# EAGLE design RamyunActionBoard (EAGLE 8.0.0)
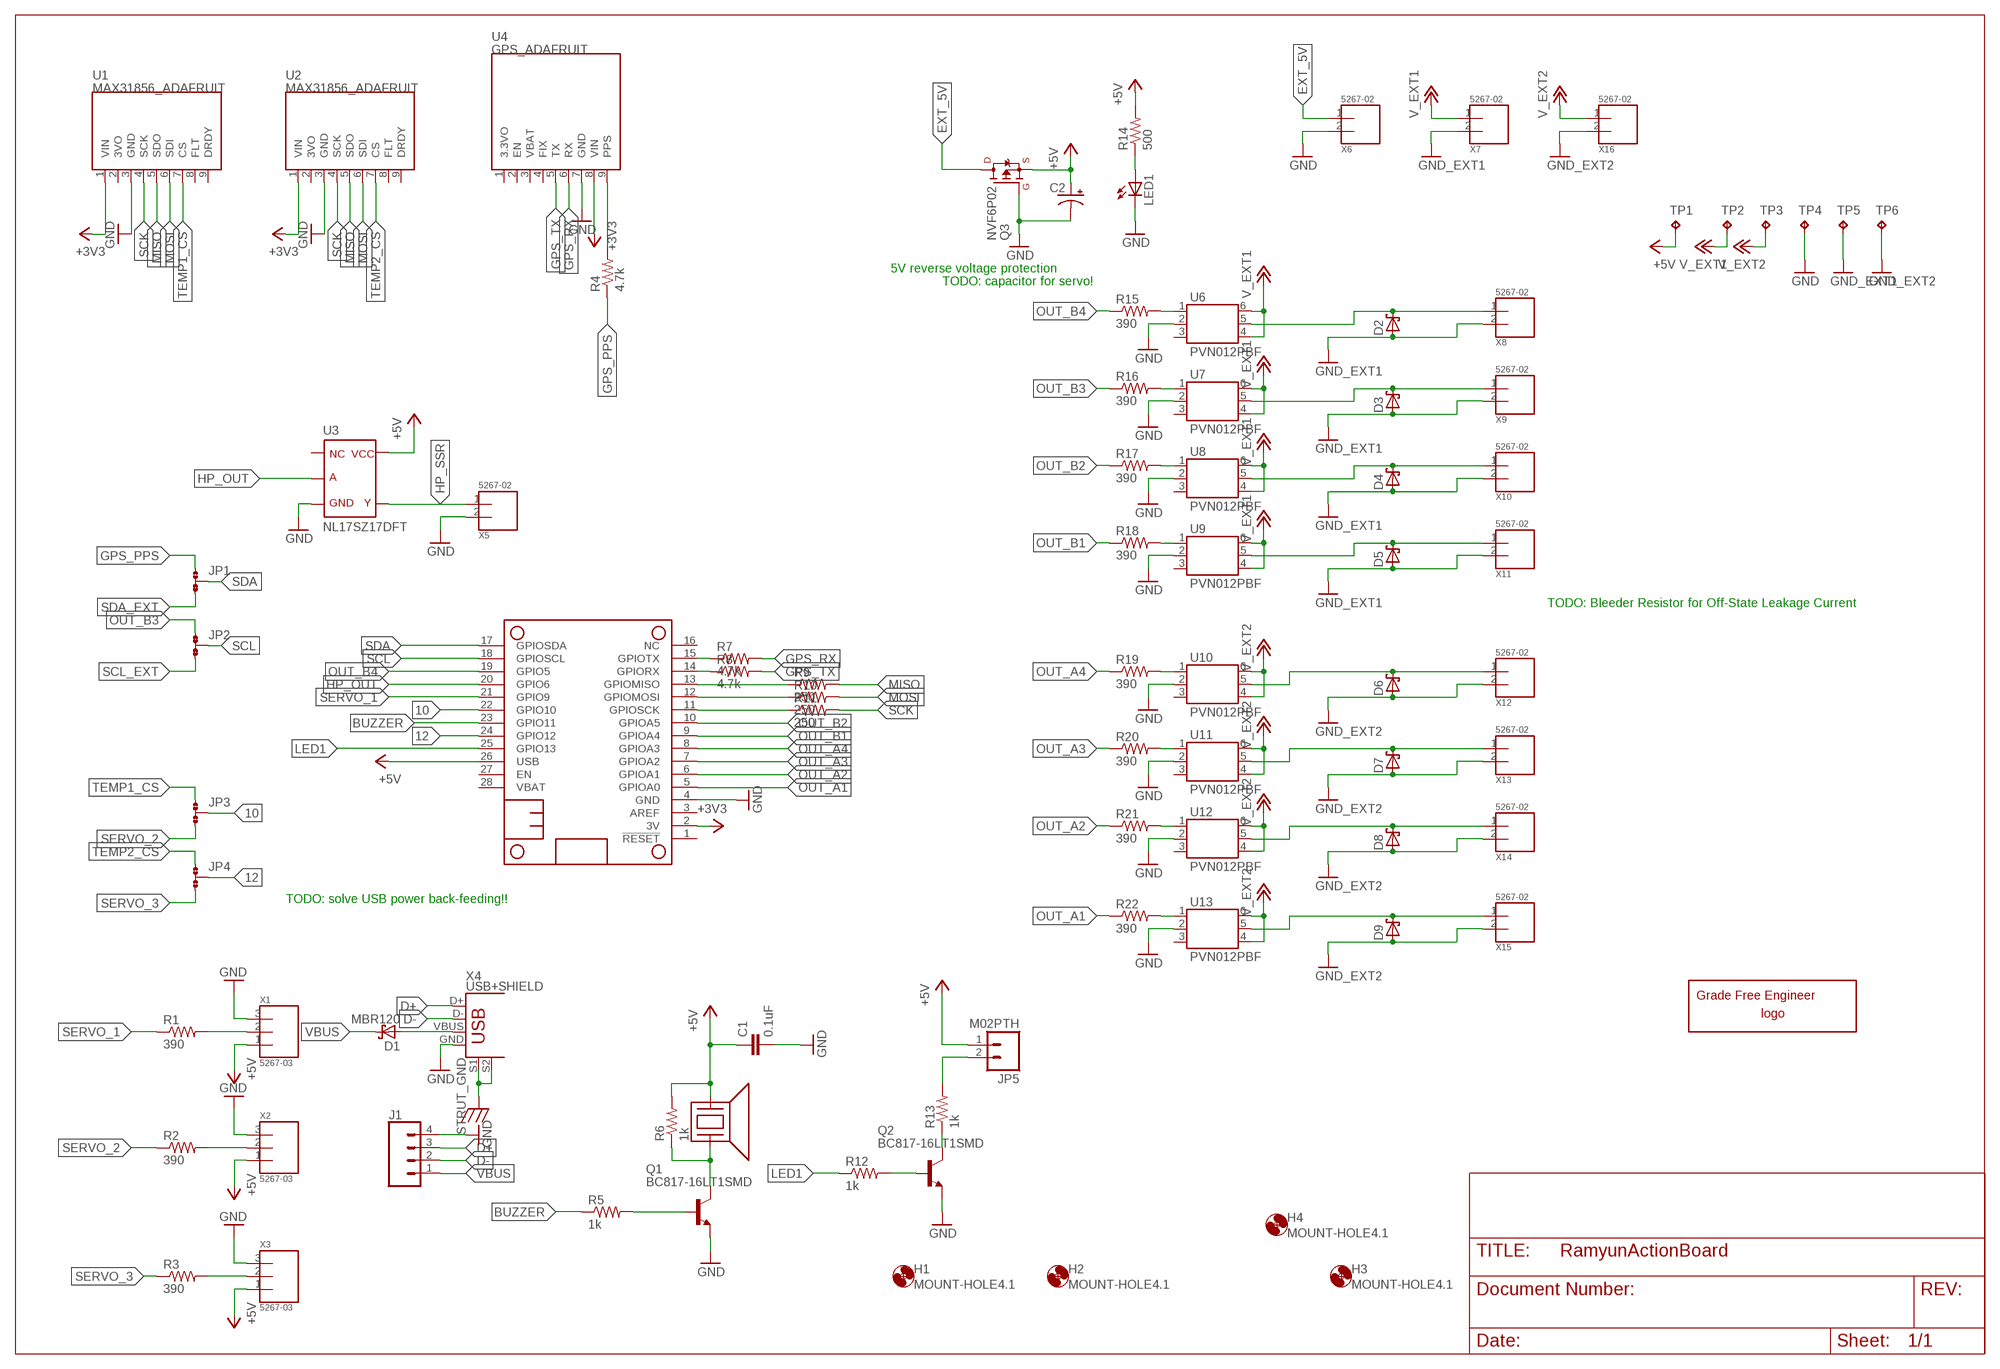
[diagram p0: schematic, sheet 1]

## Parts
C1  0.1uF  C0603(1608)_HAND  [C0603(1608)_HANDSOLDER]
C2  CPOL-USE3.5-8  [E3,5-8]
D1  MBR120  [SOD-123]
D2  MBR5200VPTR-E1_V  [DO-27-VERTICAL]
D3  MBR5200VPTR-E1_V  [DO-27-VERTICAL]
D4  MBR5200VPTR-E1_V  [DO-27-VERTICAL]
D5  MBR5200VPTR-E1_V  [DO-27-VERTICAL]
D6  MBR5200VPTR-E1_V  [DO-27-VERTICAL]
D7  MBR5200VPTR-E1_V  [DO-27-VERTICAL]
D8  MBR5200VPTR-E1_V  [DO-27-VERTICAL]
D9  MBR5200VPTR-E1_V  [DO-27-VERTICAL]
H1  MOUNT-HOLE4.1  [4,1]
H2  MOUNT-HOLE4.1  [4,1]
H3  MOUNT-HOLE4.1  [4,1]
H4  MOUNT-HOLE4.1  [4,1]
J1  CONN_04  [1X04]
JP1  JP2  [JP2SMD0603]
JP2  JP2  [JP2SMD0603]
JP3  JP2  [JP2SMD0603]
JP4  JP2  [JP2SMD0603]
JP5  M02PTH  [1X02]
LED1  LED3MM  [LED3MM]
LOGO1  GRADEFREELOGO-20  [GRADEFREELOGO-20]
MS1  FEATHERWING_NODIM  [FEATHERWING_DIM]
Q1  BC817-16LT1SMD  [SOT23-BEC]
Q2  BC817-16LT1SMD  [SOT23-BEC]
Q3  NVF6P02  [SOT223]
R1  390  R0603(1608)_HAND  [R0603(1608)_HANDSOLDER]
R2  390  R0603(1608)_HAND  [R0603(1608)_HANDSOLDER]
R3  390  R0603(1608)_HAND  [R0603(1608)_HANDSOLDER]
R4  4.7k  R0603(1608)_HAND  [R0603(1608)_HANDSOLDER]
R5  1k  R0603(1608)_HAND  [R0603(1608)_HANDSOLDER]
R6  1k  R0603(1608)_HAND  [R0603(1608)_HANDSOLDER]
R7  4.7k  R0603(1608)_HAND  [R0603(1608)_HANDSOLDER]
R8  4.7k  R0603(1608)_HAND  [R0603(1608)_HANDSOLDER]
R9  250  R0603(1608)_HAND  [R0603(1608)_HANDSOLDER]
R10  250  R0603(1608)_HAND  [R0603(1608)_HANDSOLDER]
R11  250  R0603(1608)_HAND  [R0603(1608)_HANDSOLDER]
R12  1k  R0603(1608)_HAND  [R0603(1608)_HANDSOLDER]
R13  1k  R0603(1608)_HAND  [R0603(1608)_HANDSOLDER]
R14  500  R0603(1608)_HAND  [R0603(1608)_HANDSOLDER]
R15  390  R0603(1608)_HAND  [R0603(1608)_HANDSOLDER]
R16  390  R0603(1608)_HAND  [R0603(1608)_HANDSOLDER]
R17  390  R0603(1608)_HAND  [R0603(1608)_HANDSOLDER]
R18  390  R0603(1608)_HAND  [R0603(1608)_HANDSOLDER]
R19  390  R0603(1608)_HAND  [R0603(1608)_HANDSOLDER]
R20  390  R0603(1608)_HAND  [R0603(1608)_HANDSOLDER]
R21  390  R0603(1608)_HAND  [R0603(1608)_HANDSOLDER]
R22  390  R0603(1608)_HAND  [R0603(1608)_HANDSOLDER]
TP1  TP-5010  [TP-5010]
TP2  TP-5010  [TP-5010]
TP3  TP-5010  [TP-5010]
TP4  TP-5010  [TP-5010]
TP5  TP-5010  [TP-5010]
TP6  TP-5010  [TP-5010]
U1  MAX31856_ADAFRUIT  [MAX31856_ADAFRUIT]
U2  MAX31856_ADAFRUIT  [MAX31856_ADAFRUIT]
U3  NL17SZ17DFT  [SOT-353]
U4  GPS_ADAFRUIT  [GPS_ADAFRUIT]
U5  BUZZER  [PS1240]
U6  PVN012PBF  [DIL06]
U7  PVN012PBF  [DIL06]
U8  PVN012PBF  [DIL06]
U9  PVN012PBF  [DIL06]
U10  PVN012PBF  [DIL06]
U11  PVN012PBF  [DIL06]
U12  PVN012PBF  [DIL06]
U13  PVN012PBF  [DIL06]
X1  5267-03  [5267-03]
X2  5267-03  [5267-03]
X3  5267-03  [5267-03]
X4  USB+SHIELD  [USB-B-PTH]
X5  5267-02  [5267-02]
X6  5267-02  [5267-02]
X7  5267-02  [5267-02]
X8  5267-02  [5267-02]
X9  5267-02  [5267-02]
X10  5267-02  [5267-02]
X11  5267-02  [5267-02]
X12  5267-02  [5267-02]
X13  5267-02  [5267-02]
X14  5267-02  [5267-02]
X15  5267-02  [5267-02]
X16  5267-02  [5267-02]

## Nets
10: JP3.2 MS1.22(GPIO10)
12: JP4.2 MS1.24(GPIO12)
+3V3: MS1.2(3V) U1.1(VIN) U2.1(VIN) U4.8(VIN)
+5V: C1.1 C2.+ JP5.1 MS1.26(USB) Q3.3(S) R6.2 R14.2 TP1.TP U3.5 U5.1 X1.1 X2.1 X3.1
BUZZER: MS1.23(GPIO11) R5.1
D+: J1.3 X4.D+
D-: J1.2 X4.D-
EXT_5V: Q3.2(D) Q3.4(D) X6.1
GND: C1.2 C2.- J1.4 LED1.K(C) MS1.4(GND) Q1.E Q2.E Q3.1(G) TP4.TP U1.3(GND) U2.3(GND) U3.3 U4.7(GND) U6.2 U7.2 U8.2 U9.2 U10.2 U11.2 U12.2 U13.2 X1.3 X2.3 X3.3 X4.GND X5.2 X6.2
GND_EXT1: D2.A D3.A D4.A D5.A TP5.TP X7.2 X8.2 X9.2 X10.2 X11.2
GND_EXT2: D6.A D7.A D8.A D9.A TP6.TP X12.2 X13.2 X14.2 X15.2 X16.2
GPS_PPS: JP1.1 R4.1
GPS_RX: R7.2 U4.6(RX)
GPS_TX: R8.2 U4.5(TX)
HP_OUT: MS1.20(GPIO6) U3.2
HP_SSR: U3.4 X5.1
LED1: MS1.25(GPIO13) R12.1
MISO: R9.2 U1.5(SDO) U2.5(SDO)
MOSI: R10.2 U1.6(SDI) U2.6(SDI)
N$1: R22.2 U13.1
N$2: R21.2 U12.1
N$3: R20.2 U11.1
N$4: R19.2 U10.1
N$5: R18.2 U9.1
N$6: R17.2 U8.1
N$7: R16.2 U7.1
N$8: R15.2 U6.1
N$9: R1.2 X1.2
N$10: R2.2 X2.2
N$11: R3.2 X3.2
N$12: D1.A X4.VBUS
N$13: JP5.2 R13.2
N$14: Q2.C R13.1
N$15: Q2.B R12.2
N$16: LED1.A R14.1
N$17: Q1.B R5.2
N$18: Q1.C R6.1 U5.2
N$19: MS1.15(GPIOTX) R7.1
N$20: MS1.14(GPIORX) R8.1
N$22: MS1.13(GPIOMISO) R9.1
N$24: MS1.12(GPIOMOSI) R10.1
N$25: D2.C U6.5 X8.1
N$26: D3.C U7.5 X9.1
N$27: D4.C U8.5 X10.1
N$28: D5.C U9.5 X11.1
N$29: D6.C U10.5 X12.1
N$30: D7.C U11.5 X13.1
N$31: D8.C U12.5 X14.1
N$32: D9.C U13.5 X15.1
N$33: MS1.11(GPIOSCK) R11.1
N$34: R4.2 U4.9(PPS)
OUT_A1: MS1.5(GPIOA0) R22.1
OUT_A2: MS1.6(GPIOA1) R21.1
OUT_A3: MS1.7(GPIOA2) R20.1
OUT_A4: MS1.8(GPIOA3) R19.1
OUT_B1: MS1.9(GPIOA4) R18.1
OUT_B2: MS1.10(GPIOA5) R17.1
OUT_B3: JP2.1 R16.1
OUT_B4: MS1.19(GPIO5) R15.1
SCK: R11.2 U1.4(SCK) U2.4(SCK)
SCL: JP2.2 MS1.18(GPIOSCL)
SCL_EXT: JP2.3
SDA: JP1.2 MS1.17(GPIOSDA)
SDA_EXT: JP1.3
SERVO_1: MS1.21(GPIO9) R1.1
SERVO_2: JP3.3 R2.1
SERVO_3: JP4.3 R3.1
STRUT_GND: X4.S1 X4.S2
TEMP1_CS: JP3.1 U1.7(CS)
TEMP2_CS: JP4.1 U2.7(CS)
V_EXT1: TP2.TP U6.4 U6.6 U7.4 U7.6 U8.4 U8.6 U9.4 U9.6 X7.1
V_EXT2: TP3.TP U10.4 U10.6 U11.4 U11.6 U12.4 U12.6 U13.4 U13.6 X16.1
VBUS: D1.C J1.1
Unconnected: MS1.1(!RESET) MS1.3(AREF) MS1.16(NC) MS1.27(EN) MS1.28(VBAT) U1.2(3VO) U1.8(FLT) U1.9(DRDY) U2.2(3VO) U2.8(FLT) U2.9(DRDY) U3.1 U4.1(3.3VO) U4.2(EN) U4.3(VBAT) U4.4(FIX) U6.3 U7.3 U8.3 U9.3 U10.3 U11.3 U12.3 U13.3

## Notes on the sheet
- 5V reverse voltage protection
- TODO: capacitor for servo!
- TODO: Bleeder Resistor for Off-State Leakage Current
- TODO: solve USB power back-feeding!!

## Library data of the parts
C1 = GFE:C
C2 = adafruit:CPOL-US: POLARIZED CAPACITOR, American symbol
D1 = GFE:MBR120
D2-D9 = GFE:MBR5200VPTR-E1: Diodes Incorporated 5A 0.95Vf Schottky diode
H1-H4 = holes:MOUNT-HOLE: MOUNTING HOLE with drill center marker
J1 = SparkFun-Connectors:CONN_04: Multi connection point. Often used as Generic Header-pin footprint for 0.1 inch spaced/style header connections On any of the 0.1 inch spaced packages, you can populate with these: Break Away Headers - Straight <https://www.sparkfun.com/products/116> (PRT-00116) Break Away Male Headers - Right Angle <https://www.sparkfun.com/products/553> (PRT-00553) Female Headers <https://www.sparkfun.com/products/115> (PRT-00115) Break Away Headers - Machine Pin <https://www.sparkfun.com/products/117> (PRT-00117) Break Away Female Headers - Swiss Machine Pin <https://www.sparkfun.com/products/743> (PRT-00743) For SCREWTERMINALS and SPRING TERMINALS visit here: Screw Terimnals on SparkFun.com <https://www.sparkfun.com/search/results?term=Screw+Terminals> (5mm/3.5mm/2.54mm spacing) This device is also useful as a general connection point to wire up your design to another part of your project. Our various solder wires solder well into these plated through hole pads. Hook-Up Wire - Assortment (Stranded, 22 AWG) <https://www.sparkfun.com/products/11375> (PRT-11375) Hook-Up Wire - Assortment (Solid Core, 22 AWG) <https://www.sparkfun.com/products/11367> (PRT-11367) View the entire wire category on our website here <https://www.sparkfun.com/categories/141> Special notes: Molex polarized connector foot print use with SKU : PRT-08231 with associated crimp pins and housings. 1MM SMD Version SKU: PRT-10208; PROD_ID: CONN-09696
JP1-JP4 = GFE:JP2
JP5 = berry:M02: Standard 2-pin 0.1" header. Use with - straight break away headers ( PRT-00116) - right angle break away headers (PRT-00553) - swiss pins (PRT-00743) - machine pins (PRT-00117) - female headers (PRT-00115) Molex polarized connector foot print use with: PRT-08233 with associated crimp pins and housings. 2.54_SCREWTERM for use with PRT-10571. 3.5mm Screw Terminal footprints for PRT-08084 5mm Screw Terminal footprints for use with PRT-08433
LED1 = GFE:LED: LEDs Standard schematic elements and footprints for 5mm, 3mm, 1206, and 0603 sized LEDs. 5mm - Spark Fun Electronics SKU : COM-00529 (and others)
LOGO1 = GFE:GRADEFREELOGO
MS1 = GFE:FEATHERWING
Q1 Q2 = GFE:BC817*: NPN Transistor
Q3 = GFE:NVF6P02
R1-R22 = GFE:R
TP1-TP6 = berry:TP
U1 U2 = GFE:MAX31856_ADAFRUIT
U3 = GFE:NL17SZ17: NL17S17 Single Non-Iverting Buffer with Schmitt Trigger Source/Sink 24mA at 3.0 Volts 1.65V ~ 5.5V Vcc Operation
U4 = GFE:GPS_ADAFRUIT
U5 = GFE:BUZZER
U6-U13 = GFE:PVN012PBF: PVN012PBF 20V 4A Infineon SSR
X1-X3 = GFE:5267-03
X4 = GFE:USB+SHIELD: USB+Shield USB connector with shield pins connectable
X5-X16 = GFE:5267-02

## Board
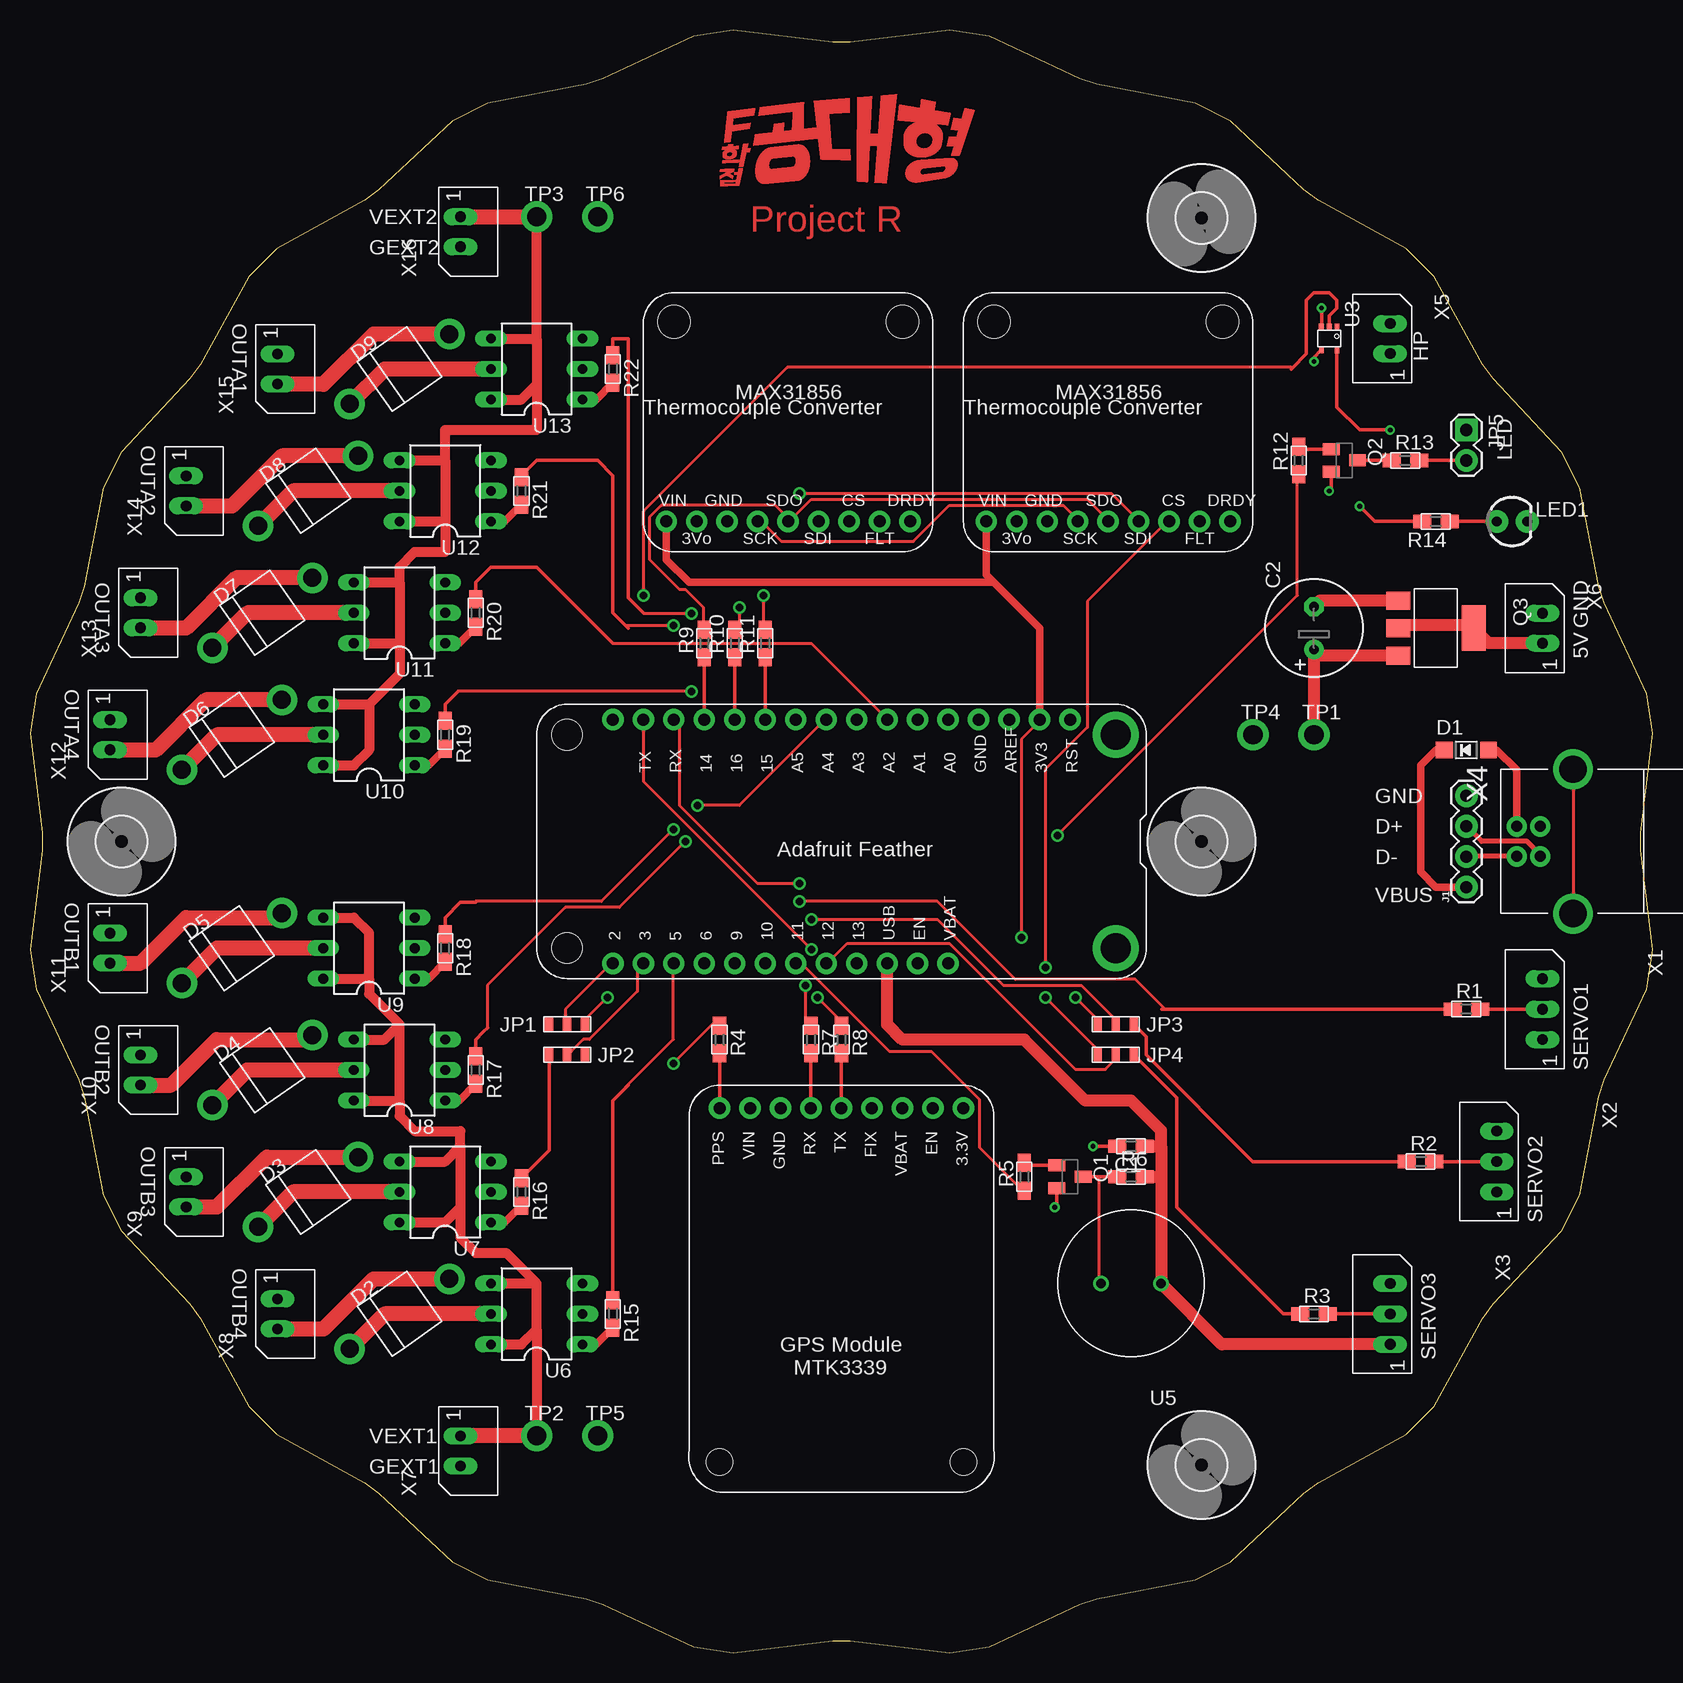
[diagram p1: board, top side]
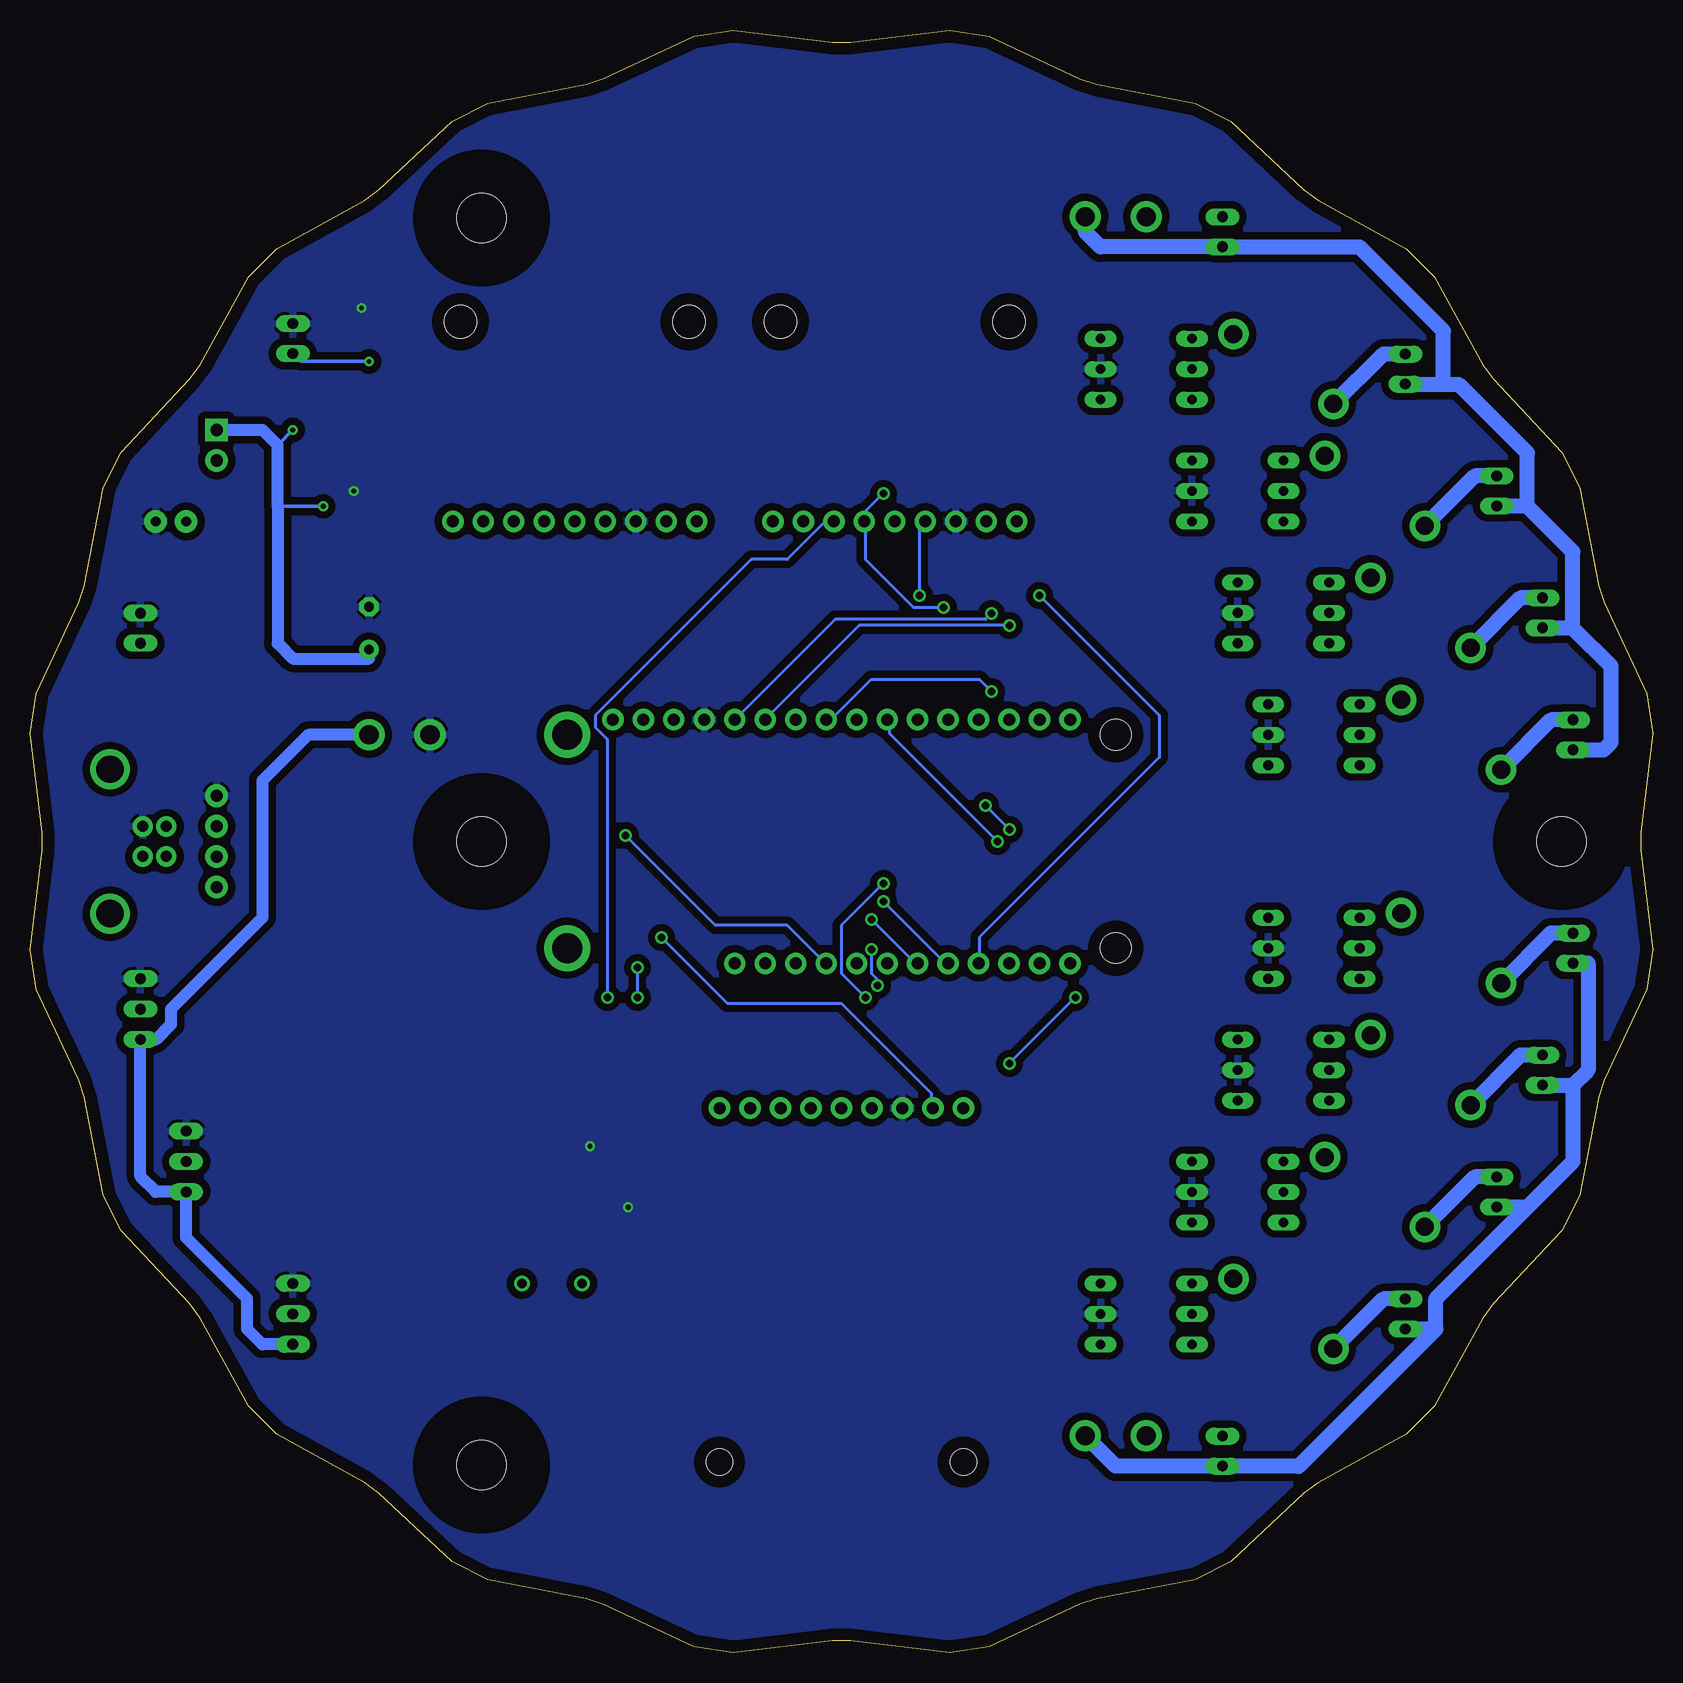
[diagram p2: board, bottom side, seen from below]

Size 135.24 x 135.24 mm. Coordinates in mm from the lower left corner, seen from the top.
Outline: 46.34,4.52 47.75,4.06 55.31,0.52 58.6,0 66.88,1.03 68.36,1.03 76.65,0 79.93,0.52 87.5,4.06 88.9,4.52 97.1,6.1 100.07,7.61 106.17,13.31 107.36,14.18 114.67,18.22 117.02,20.57 121.06,27.88 121.93,29.08 127.64,35.18 129.15,38.14 130.73,46.34 131.18,47.75 134.72,55.31 135.24,58.6 134.21,66.88 134.21,68.36 135.24,76.65 134.72,79.93 131.18,87.5 130.73,88.9 129.15,97.1 127.64,100.07 121.93,106.17 121.06,107.36 117.02,114.67 114.67,117.02 107.36,121.06 106.17,121.93 100.07,127.64 97.1,129.15 88.9,130.73 87.5,131.18 79.93,134.72 76.65,135.24 68.36,134.21 66.88,134.21 58.6,135.24 55.31,134.72 47.75,131.18 46.34,130.73 38.14,129.15 35.18,127.64 29.08,121.93 27.88,121.06 20.57,117.02 18.22,114.67 14.18,107.36 13.31,106.17 7.61,100.07 6.1,97.1 4.52,88.9 4.06,87.5 0.52,79.93 0,76.65 1.03,68.36 1.03,66.88 0,58.6 0.52,55.31 4.06,47.75 4.52,46.34 6.1,38.14 7.61,35.18 13.31,29.08 14.18,27.88 18.22,20.57 20.57,18.22 27.88,14.18 29.08,13.31 35.18,7.61 38.14,6.1 46.34,4.52
Copper layers (1*16): Top 0.035mm / dielectric 1.5mm / Bottom 0.035mm
Design rules "default": minimum track width 10mil, minimum drill 24mil, track to track 8mil, track to pad 8mil, pad to pad 8mil, via to via 8mil, smd to smd 8mil, copper to edge 40mil, drill to drill 8mil, minimum pad ring 10mil, minimum via ring 8mil, stop-mask expansion 4mil, vias tented up to drill 0mil, thermal gap 10mil

### Footprints (pad centres in the part's own frame; a part is rotated, then mirrored left to right if it is on the bottom)
C0603(1608)_HANDSOLDER = smd 1.5 x 1.1: 1 -1.15,0; 2 1.15,0
E3,5-8 = drill 0.813 pad 1.6: + -1.778,0 | drill 0.813 pad 1.6 octagon: - 1.778,0
SOD-123 = smd 1.4 x 1.4: A 1.85,0; C -1.85,0
DO-27-VERTICAL = drill 1.5 pad 2.54: A 5.08,0; C -5.08,0
4,1 = hole 4.1: 0,0
1X04 = drill 1.016 pad 1.88: 1 0,0; 2 2.54,0; 3 5.08,0; 4 7.62,0
JP2SMD0603 = smd 0.7 x 1.1: 1 -1.5,0; 2 0,0; 3 1.5,0
1X02 = drill 1.016 pad 1.88 square: 1 0,0 | drill 1.016 pad 1.88: 2 2.54,0
LED3MM = drill 0.813 pad 1.88: A -1.27,0; K 1.27,0
FEATHERWING_DIM = drill 1 pad 1.778: 1 -19.05,-10.16; 2 -16.51,-10.16; 3 -13.97,-10.16; 4 -11.43,-10.16; 5 -8.89,-10.16; 6 -6.35,-10.16; 7 -3.81,-10.16; 8 -1.27,-10.16; 9 1.27,-10.16; 10 3.81,-10.16; 11 6.35,-10.16; 12 8.89,-10.16; 13 11.43,-10.16; 14 13.97,-10.16; 15 16.51,-10.16; 16 19.05,-10.16; 17 19.05,10.16; 18 16.51,10.16; 19 13.97,10.16; 20 11.43,10.16; 21 8.89,10.16; 22 6.35,10.16; 23 3.81,10.16; 24 1.27,10.16; 25 -1.27,10.16; 26 -3.81,10.16; 27 -6.35,10.16; 28 -8.89,10.16 | drill 2.5 pad 3.81: P$1 -22.86,8.89; P$2 -22.86,-8.89 | hole 2.54: 22.86,8.89; 22.86,-8.89
SOT23-BEC = smd 1 x 1.4: B -0.95,-1.1; C 0,1.1; E 0.95,-1.1
SOT223 = smd 1.5 x 2: 1 -2.3,-3.15; 2 0,-3.15; 3 2.3,-3.15 | smd 3.8 x 2: 4 0,3.15
R0603(1608)_HANDSOLDER = smd 1.5 x 1.1: 1 -1.15,0; 2 1.15,0
TP-5010 = drill 1.6 pad 2.6: TP 0,0
MAX31856_ADAFRUIT = drill 1 pad 1.778: 1 1.905,2.54; 2 4.445,2.54; 3 6.985,2.54; 4 9.525,2.54; 5 12.065,2.54; 6 14.605,2.54; 7 17.145,2.54; 8 19.685,2.54; 9 22.225,2.54 | hole 2.7: 2.54,19.177; 21.59,19.177
SOT-353 = smd 0.4 x 0.55: 1 -0.65,-0.95; 2 0,-0.95; 3 0.65,-0.95; 4 0.64,0.95; 5 -0.65,0.95
GPS_ADAFRUIT = drill 1 pad 1.778: 1 -10.16,-14.605; 2 -7.62,-14.605; 3 -5.08,-14.605; 4 -2.54,-14.605; 5 0,-14.605; 6 2.54,-14.605; 7 5.08,-14.605; 8 7.62,-14.605; 9 10.16,-14.605 | hole 2.2: -10.16,14.875; 10.16,14.875
PS1240 = drill 0.8: 1 -2.5,0; 2 2.5,0
DIL06 = drill 0.813 long: 1 -2.54,-3.81; 2 0,-3.81; 3 2.54,-3.81; 4 2.54,3.81; 5 0,3.81; 6 -2.54,3.81
5267-03 = drill 0.9 long: 1 2.54,0; 2 0,0; 3 -2.54,0
USB-B-PTH = drill 0.914 pad 1.676: D+ 2.718,1.25; D- 4.699,1.25; GND 2.718,-1.25; VBUS 4.699,-1.25 | drill 2.286: S1 0,-6.02; S2 0,6.02
5267-02 = drill 0.9 long: 1 1.25,0; 2 -1.25,0

### Placement (x,y rotation side)
C1  91.75,42.22 180 top
C2  106.99,85.4 90 top
D1  119.69,75.24 0 top
D2  30.79,28.25 35 top
D3  23.17,38.41 35 top
D4  19.36,48.57 35 top
D5  16.82,58.73 35 top
D6  16.82,76.51 35 top
D7  19.36,86.67 35 top
D8  23.17,96.83 35 top
D9  30.79,106.99 35 top
H1  97.62,119.58 330 top
H2  7.62,67.62 0 top
H3  97.62,15.66 0 top
H4  97.62,67.62 0 top
J1  119.69,63.81 90 top
JP1  44.76,52.38 180 top
JP2  44.76,49.84 0 top
JP3  90.48,52.38 0 top
JP4  90.48,49.84 0 top
JP5  119.69,101.91 270 top
LED1  123.5,94.29 0 top
LOGO1  57.46,122.23 0 top
MS1  67.62,67.62 180 top
Q1  86.67,39.68 270 top
Q2  109.53,99.37 270 top
Q3  117.15,85.4 270 top
R1  119.69,53.65 0 top
R2  115.88,40.95 0 top
R3  106.99,28.25 0 top
R4  57.46,51.11 270 top
R5  82.86,39.68 90 top
R6  91.75,39.68 0 top
R7  65.08,51.11 270 top
R8  67.62,51.11 270 top
R9  56.19,84.13 90 top
R10  58.73,84.13 90 top
R11  61.27,84.13 90 top
R12  105.72,99.37 90 top
R13  114.61,99.37 0 top
R14  117.15,94.29 180 top
R15  48.57,28.25 270 top
R16  40.95,38.41 270 top
R17  37.14,48.57 270 top
R18  34.6,58.73 270 top
R19  34.6,76.51 270 top
R20  37.14,86.67 270 top
R21  40.95,96.83 270 top
R22  48.57,106.99 270 top
TP1  106.99,76.51 0 top
TP2  42.22,18.09 0 top
TP3  42.22,119.69 0 top
TP4  101.91,76.51 0 top
TP5  47.3,18.09 0 top
TP6  47.3,119.69 0 top
U1  51.11,91.75 0 top
U2  77.78,91.75 0 top
U3  108.26,109.53 180 top
U4  67.62,30.79 180 top
U5  91.75,30.79 180 top
U6  42.22,28.25 90 top
U7  34.6,38.41 90 top
U8  30.79,48.57 90 top
U9  28.25,58.73 90 top
U10  28.25,76.51 90 top
U11  30.79,86.67 90 top
U12  34.6,96.83 90 top
U13  42.22,106.99 90 top
X1  126.04,53.65 270 top
X2  122.23,40.95 270 top
X3  113.34,28.25 270 top
X4  128.58,67.62 180 top
X5  113.34,109.53 270 top
X6  126.04,85.4 270 top
X7  35.87,16.82 90 top
X8  20.63,28.25 90 top
X9  13.01,38.41 90 top
X10  9.2,48.57 90 top
X11  6.66,58.73 90 top
X12  6.66,76.51 90 top
X13  9.2,86.67 90 top
X14  13.01,96.83 90 top
X15  20.63,106.99 90 top
X16  35.87,118.42 90 top

### Tracks (layer width: path | path; a pad name or v marks a point on that pad's centre or on a via)
10  (via drill 0.61)
  Top 0.254: v65.12,61.12 75.62,61.12 81.12,55.62 87.62,55.62 90.62,52.62 JP3.2
  Bottom 0.254: v65.12,61.12 61.62,57.62 MS1.22
12
  Top 0.254: JP4.2 90.62,49.62 89.62,48.62 87.12,48.62 76.62,59.12 68.12,59.12 66.62,57.62 MS1.24
+3V3  (via drill 0.61)
  Top 0.254: v82.62,59.62 82.62,76.12 84.12,77.62 MS1.2
  Top 0.61: MS1.2 84.13,85.4 80.32,89.21 | 80.32,89.21 54.92,89.21 53.02,91.12 U1.1 | U2.1 79.69,89.85 80.32,89.21
  Bottom 0.254: v82.62,59.62 77.12,54.12 67.62,54.12 60.12,46.62 60.12,45.62 U4.8
+5V  (via drill 0.4)
  Top 0.305: R14.2 112.07,94.29 v110.8,95.56 | v113.34,101.91 110.8,101.91 108.9,103.82 108.9,108.57 U3.5
  Top 1.016: Q3.3 107.51,83.1 C2.+ TP1.TP | X3.1 99.33,25.71 U5.1 94.25,39.68 | 94.25,42.22 94.25,39.68 | 94.25,42.22 94.25,43.53 91.75,46.03 87.94,46.03 82.86,51.11 72.7,51.11 71.43,52.38 MS1.26 | R6.2 94.25,39.68 | C1.1 94.25,42.22
  Bottom 0.305: v110.8,95.56 114.61,95.56 | v113.34,101.91 114.61,100.64
  Bottom 1.016: TP1.TP 112.07,76.51 115.88,72.7 115.88,61.27 123.5,53.65 123.5,52.38 124.77,51.11 X1.1 126.04,39.68 124.77,38.41 X2.1 122.23,34.6 117.15,29.52 117.15,26.98 115.88,25.71 X3.1 | JP5.1 115.88,101.91 114.61,100.64 114.61,95.56 114.61,84.13 113.34,82.86 106.99,82.86 C2.+
BUZZER
  Top 0.254: R5.1 82.62,38.62 79.12,42.12 79.12,46.12 75.12,50.12 71.62,50.12 64.12,57.62 MS1.23
  Top 0.305: R5.1 82.86,38.41
D+
  Top 0.406: X4.D+ 125.86,66.53 124.77,67.62 120.96,67.62 J1.3
D-
  Top 0.406: X4.D- 119.71,66.37 J1.2
EXT_5V
  Top 0.254: Q3.2 114.12,85.62 | Q3.4 120.12,85.62
  Top 1.016: X6.1 121.55,84.15 Q3.4 | 120.12,85.62 114.22,85.62 Q3.2
GND  (via drill 0.4)
  Top 0.305: Q2.E 108.43,97 v108.26,96.83 | C1.2 v88.58,42.22 | Q1.E 85.57,37.31 v85.4,37.14 | U3.3 107.63,110.48 v107.63,112.07
  Top 1.016: Q3.1 107.51,87.7 C2.-
  pour Bottom (isolate 0.61): -0.96,67.62 -0.96,71.2 arc-90 64.04,136.2 67.62,136.2 71.2,136.2 arc-90 136.2,71.2 136.2,67.62 136.2,64.04 arc-90 71.2,-0.96 67.62,-0.96 64.04,-0.96 arc-90 -0.96,64.04
GND_EXT1
  Top 1.27: X11.2 9.22,57.48 13.01,61.27 20.61,61.27 D5.A | X10.2 11.76,47.32 15.55,51.11 23.15,51.11 D4.A | D3.A 19.74,41.33 15.57,37.16 X9.2 | D2.A 28.63,31.17 24.46,27 X8.2
  Bottom 1.27: X11.2 5.41,57.48 5.39,57.46 5.39,48.57 6.66,47.3 | 6.66,47.3 6.66,40.95 10.47,37.14 | 18.09,26.98 18.09,29.52 10.47,37.14 | 18.09,26.98 29.52,15.55 35.85,15.55 X7.2 44.78,15.57 TP5.TP | X10.2 6.68,47.32 6.66,47.3 | X9.2 10.49,37.16 10.47,37.14 | X8.2 18.11,27 18.09,26.98
GND_EXT2
  Top 1.27: D6.A 14.66,79.43 10.47,75.24 6.68,75.24 X12.2 | D7.A 17.2,89.59 13.01,85.4 9.22,85.4 X13.2 | D8.A 21.01,99.75 16.82,95.56 13.03,95.56 X14.2 | D9.A 28.63,109.91 24.44,105.72 20.65,105.72 X15.2
  Bottom 1.27: X12.2 4.1,75.26 3.49,75.88 3.49,82.23 6.66,85.4 | 6.66,85.4 6.66,91.75 10.47,95.56 | 10.47,95.56 10.47,100.01 16.19,105.72 17.46,105.72 | 17.46,105.72 17.46,110.17 24.44,117.15 35.85,117.15 X16.2 46.05,117.17 47.3,118.42 TP6.TP | X15.2 17.48,105.74 17.46,105.72 | X14.2 10.49,95.58 10.47,95.56 | X13.2 6.68,85.42 6.66,85.4
GPS_PPS  (via drill 0.61)
  Top 0.254: v48.12,54.62 46.12,52.62 JP1.1 | v53.62,49.12 57.12,52.62 R4.1
  Bottom 0.254: v53.62,49.12 v48.12,54.62
GPS_RX
  Top 0.305: U4.6 R7.2
GPS_TX
  Top 0.305: U4.5 R8.2
HP_OUT  (via drill 0.61)
  Top 0.254: v51.12,88.12 51.12,95.12 63.12,107.12 105.12,107.12 105.17,107.08
  Top 0.305: U3.2 108.28,111.45 108.9,112.07 108.9,112.71 108.26,113.34 106.99,113.34 106.36,112.71 106.36,108.26 105.17,107.08 105.09,106.99
  Bottom 0.254: v51.12,88.12 41.12,78.12 41.12,74.62 56.12,59.62 56.12,57.62 MS1.20
HP_SSR  (via drill 0.4)
  Top 0.305: 107.14,107.78 v106.99,107.63 106.99,107.95 U3.4
  Bottom 0.305: v106.99,107.63 112.69,107.63 X5.1
LED1  (via drill 0.61)
  Top 0.254: v85.62,68.12 105.62,88.12 105.62,98.12 R12.1
  Bottom 0.254: v85.62,68.12 78.12,60.62 72.12,60.62 69.12,57.62 MS1.25
MISO
  Top 0.254: R9.2 56.12,85.62 56.12,87.12 54.62,88.62 54.12,88.62 51.62,91.12 51.62,94.62 52.62,95.62 62.12,95.62 63.12,94.62 U1.5 63.62,94.62 65.12,96.12 88.12,96.12 89.62,94.62 U2.5
MOSI  (via drill 0.61)
  Top 0.254: v59.12,87.12 59.12,85.62 R10.2 | v64.12,96.62 90.12,96.62 92.12,94.62 U2.6
  Bottom 0.254: v59.12,87.12 61.62,87.12 65.62,91.12 65.62,94.12 U1.6 66.12,94.62 v64.12,96.62
N$1
  Top 0.61: U13.1 47.18,104.45 R22.2
N$2
  Top 0.61: U12.1 39.56,94.29 R21.2
N$3
  Top 0.61: U11.1 35.75,84.13 R20.2
N$4
  Top 0.61: U10.1 33.21,73.97 R19.2
N$5
  Top 0.61: U9.1 33.21,56.19 R18.2
N$6
  Top 0.61: U8.1 35.75,46.03 R17.2
N$7
  Top 0.61: U7.1 39.56,35.87 R16.2
N$8
  Top 0.61: U6.1 47.18,25.71 R15.2
N$9
  Top 0.305: R1.2 X1.2
N$10
  Top 0.305: R2.2 X2.2
N$11
  Top 0.305: R3.2 X3.2
N$12
  Top 0.61: X4.VBUS 123.88,73.59 122.23,75.24 D1.A
N$13
  Top 0.305: JP5.2 R13.2
N$14
  Top 0.305: R13.1 Q2.C
N$15
  Top 0.305: Q2.B 105.92,100.32 R12.2
N$16
  Top 0.305: LED1.A R14.1
N$17
  Top 0.305: Q1.B 83.06,40.63 R5.2
N$18
  Top 0.254: 89.12,39.68 89.12,31.12 U5.2
  Top 0.305: R6.1 89.12,39.68 Q1.C
N$19  (via drill 0.61)
  Top 0.254: v64.62,55.62 64.62,52.62 R7.1 | v65.12,58.62 51.12,72.62 51.12,77.62 MS1.15
  Bottom 0.254: v64.62,55.62 64.62,56.12 65.12,56.62 v65.12,58.62
N$20  (via drill 0.61)
  Top 0.254: v65.62,54.62 67.62,52.62 R8.1 | v64.12,64.12 60.62,64.12 54.12,70.62 54.12,77.62 MS1.14
  Bottom 0.254: v65.62,54.62 67.62,56.62 67.62,60.62 v64.12,64.12
N$22
  Top 0.305: MS1.13 R9.1
N$24
  Top 0.305: MS1.12 R10.1
N$25
  Top 1.27: U6.5 29.54,28.25 D2.C
  Bottom 1.27: X8.1 22.47,29.5 D2.C
N$26
  Top 1.27: U7.5 21.92,38.41 D3.C
  Bottom 1.27: X9.1 14.85,39.66 D3.C
N$27
  Top 1.27: U8.5 18.09,48.57 15.55,46.03 15.55,46.01 D4.C
  Bottom 1.27: X10.1 11.04,49.82 D4.C
N$28
  Top 1.27: U9.5 15.57,58.73 D5.C
  Bottom 1.27: X11.1 8.5,59.98 D5.C
N$29
  Top 1.27: U10.5 15.57,76.51 D6.C
  Bottom 1.27: X12.1 8.5,77.76 D6.C
N$30
  Top 1.27: U11.5 18.11,86.67 D7.C
  Bottom 1.27: X13.1 11.04,87.92 D7.C
N$31
  Top 1.27: U12.5 21.92,96.83 D8.C
  Bottom 1.27: X14.1 14.85,98.08 D8.C
N$32
  Top 1.27: U13.5 29.54,106.99 D9.C
  Bottom 1.27: X15.1 22.47,108.24 D9.C
N$33
  Top 0.305: MS1.11 R11.1
N$34
  Top 0.305: U4.9 R4.2
OUT_A1  (via drill 0.61)
  Top 0.254: v55.12,86.62 51.12,86.62 51.11,86.67
  Top 0.305: R22.1 48.57,109.53 49.84,109.53 49.84,87.94 51.11,86.67
  Bottom 0.254: v55.12,86.62 55.62,86.12 68.12,86.12 76.12,78.12 MS1.5
OUT_A2  (via drill 0.61)
  Top 0.254: 49.62,85.62 v53.62,85.62
  Top 0.305: R21.1 40.95,98.1 42.22,99.37 47.3,99.37 48.57,98.1 48.57,86.67 49.62,85.62 49.84,85.4
  Bottom 0.254: v53.62,85.62 66.12,85.62 73.62,78.12 MS1.6
OUT_A3
  Top 0.254: MS1.7 71.12,78.12 65.12,84.12 48.62,84.12 48.57,84.13
  Top 0.305: R20.1 37.14,89.21 38.41,90.48 42.22,90.48 48.57,84.13
OUT_A4  (via drill 0.61)
  Top 0.254: v55.12,80.12 35.62,80.12 35.65,80.1
  Top 0.305: R19.1 34.6,79.05 35.65,80.1
  Bottom 0.254: v55.12,80.12 56.12,81.12 65.12,81.12 68.62,77.62 MS1.8
OUT_B1  (via drill 0.61)
  Top 0.254: v53.62,68.62 47.62,62.62 37.12,62.62 37.12,62.54 | v55.62,70.62 59.12,70.62 66.12,77.62 MS1.9
  Top 0.305: R18.1 34.6,61.27 35.87,62.54 37.12,62.54 37.14,62.54
  Bottom 0.254: v55.62,70.62 v53.62,68.62
OUT_B2  (via drill 0.61)
  Top 0.254: v54.62,67.62 49.12,62.12 44.62,62.12 38.12,55.62 38.12,52.12 38.14,52.11
  Top 0.305: R17.1 37.14,51.11 37.78,51.75 38.14,52.11
  Bottom 0.254: v54.62,67.62 63.62,76.62 63.62,77.62 MS1.10
OUT_B3
  Top 0.305: JP2.1 43.26,41.87 R16.1
OUT_B4
  Top 0.254: MS1.19 53.62,57.12 53.62,51.12 49.62,47.12 49.64,47.1
  Top 0.305: R15.1 48.57,46.03 49.64,47.1 49.84,47.3
SCK  (via drill 0.61)
  Top 0.254: v61.12,88.12 61.12,85.62 R11.2 | U2.4 87.12,94.62 86.12,95.62 76.62,95.62 73.62,92.62 62.62,92.62 61.12,94.12 U1.4
  Bottom 0.254: v61.12,88.12 61.12,94.12 U1.4
SCL
  Top 0.254: JP2.2 44.62,50.12 45.12,50.12 46.12,51.12 46.62,51.12 50.62,55.12 50.62,57.12 MS1.18
SDA
  Top 0.254: JP1.2 44.62,52.62 44.62,53.62 48.12,57.12 MS1.17
SERVO_1  (via drill 0.61)
  Top 0.254: v64.12,62.62 75.62,62.62 82.12,56.12 92.12,56.12 94.62,53.62 94.62,53.65
  Top 0.305: R1.1 94.62,53.65 94.29,53.65
  Bottom 0.254: v64.12,62.62 59.12,57.62 MS1.21
SERVO_2
  Top 0.305: R2.1 101.91,40.95 93.02,49.84 93.02,51.34 JP3.3
SERVO_3
  Top 0.305: R3.1 104.45,28.25 95.56,37.14 95.56,46.26 JP4.3
STRUT_GND
  Top 0.254: X4.S2 128.62,61.62 128.62,73.62 X4.S1
TEMP1_CS  (via drill 0.61)
  Top 0.254: v87.12,54.62 89.12,52.62 JP3.1
  Bottom 0.254: v87.12,54.62 87.12,76.12 88.12,77.12 88.12,78.12 75.12,91.12 72.12,91.12 68.62,94.62 U1.7
TEMP2_CS  (via drill 0.61)
  Top 0.254: v84.62,54.62 89.12,50.12 JP4.1 | v84.62,57.12 84.62,73.62 88.12,77.12 88.12,87.62 94.62,94.12 U2.7
  Bottom 0.254: v84.62,57.12 v84.62,54.62
V_EXT1
  Top 0.813: U9.4 26.98,61.27 28.25,60 28.25,56.19 | 28.25,56.19 28.25,54.92 30.79,52.38 | 30.79,46.03 30.79,52.38 | 30.79,46.03 30.79,44.76 32.06,43.49 35.87,43.49 35.87,42.22 | 35.87,42.22 35.87,37.14 | 35.87,37.14 35.87,34.6 37.14,33.33 39.68,33.33 42.22,30.79 | 42.22,26.98 42.22,30.79 | 42.22,26.98 TP2.TP | U6.4 42.22,30.79 | U6.6 40.95,25.71 42.22,26.98 | U7.6 34.6,35.87 35.87,37.14 | U7.4 34.6,40.95 35.87,42.22 | U8.6 30.79,46.03 | U8.4 29.52,51.11 30.79,52.38 | U9.6 28.25,56.19
  Top 1.27: TP2.TP 35.89,18.09 X7.1
V_EXT2
  Top 0.813: U10.6 26.98,73.97 28.25,75.24 28.25,79.05 | 28.25,79.05 30.79,81.59 30.79,84.13 | 30.79,89.21 30.79,84.13 | 30.79,89.21 30.79,90.48 32.06,91.75 34.6,91.75 34.6,94.29 | 34.6,99.37 34.6,94.29 | 34.6,99.37 34.6,101.91 42.22,101.91 42.22,105.72 | 42.22,109.53 42.22,105.72 | 42.22,109.53 TP3.TP | U10.4 28.25,79.05 | U11.6 30.79,84.13 | U11.4 30.79,89.21 | U12.6 34.6,94.29 | U12.4 34.6,99.37 | U13.6 40.95,104.45 42.22,105.72 | U13.4 42.22,109.53
  Top 1.27: X16.1 42.2,119.67 TP3.TP
VBUS
  Top 0.61: D1.C 117.15,75.24 115.88,73.97 115.88,65.08 117.15,63.81 J1.1

### Text on the board
Top: Project R
tPlace: VEXT2 | GEXT2 | OUTA1 | HP | OUTA2 | LED | OUTA3 | GND | 5V | OUTA4 | GND | D+ | D- | OUTB1 | VBUS | OUTB2 | SERVO1 | OUTB3 | SERVO2 | OUTB4 | SERVO3 | VEXT1 | GEXT1
tStop: Project R